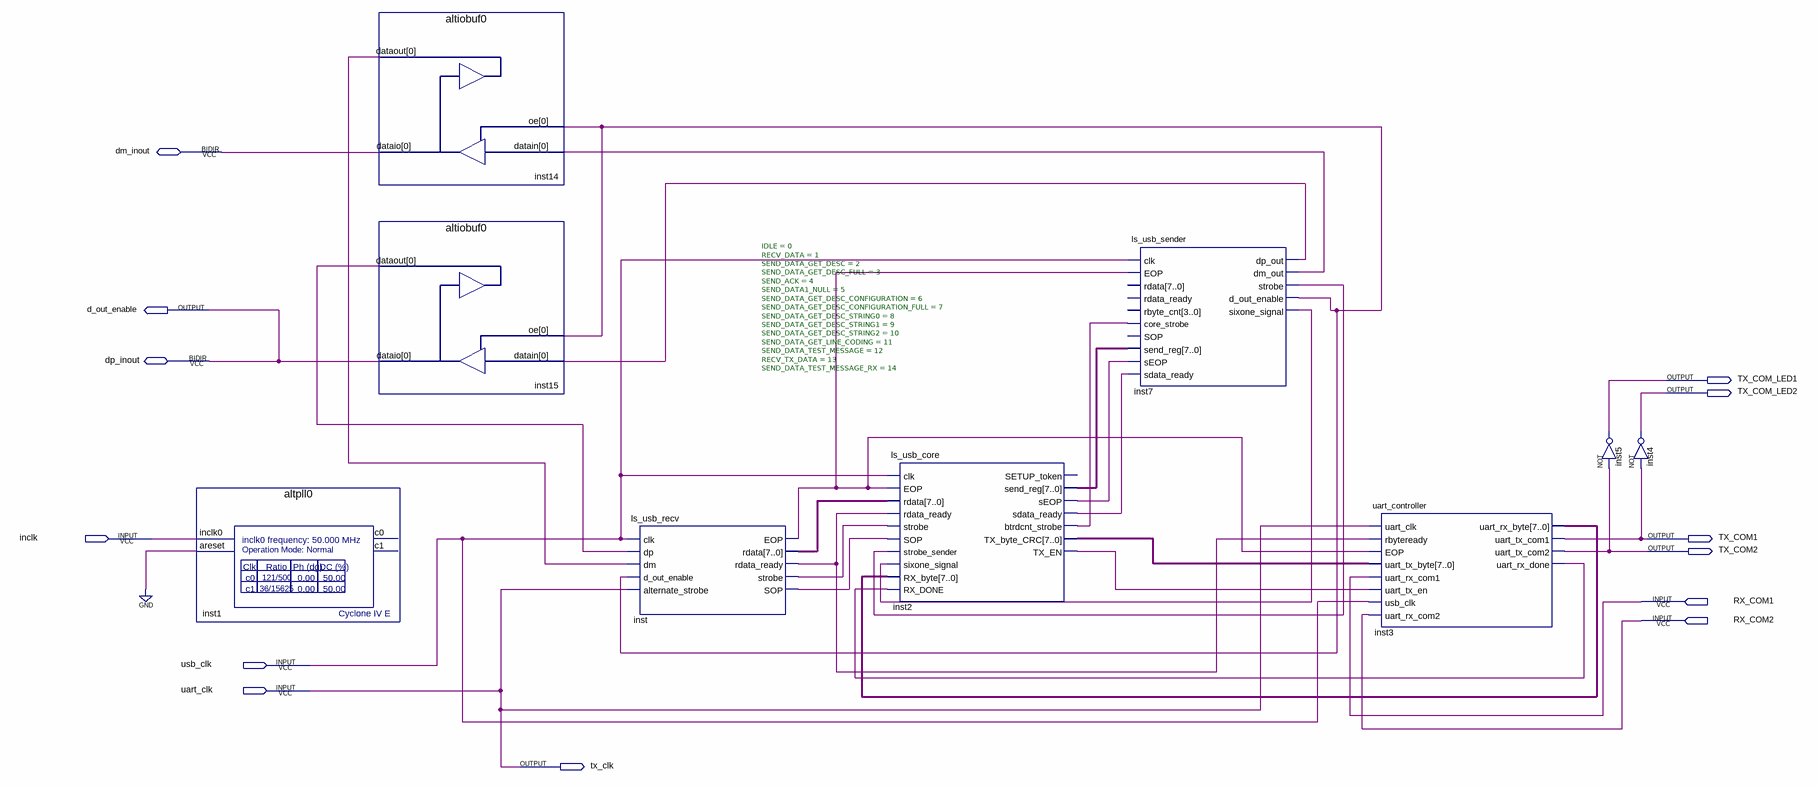
[diagram p0: schematic sheet]
// Quartus schematic Block1_temp.bdf as structural Verilog: 9 symbols, 13 pins
module Block1_temp (
  input  inclk,
  input  RX_COM1,
  input  RX_COM2,
  input  usb_clk,
  input  uart_clk,
  inout  dm_inout,
  inout  dp_inout,
  output d_out_enable,
  output TX_COM_LED1,
  output TX_COM_LED2,
  output TX_COM1,
  output TX_COM2,
  output tx_clk
);

  wire inst2_btrdcnt_strobe, inst2_sdata_ready, inst2_seop, inst2_tx_en, inst3_uart_rx_done,
       inst7_d_out_enable, inst7_dm_out, inst7_dp_out, inst7_sixone_signal, inst7_strobe, inst14_dataout,
       inst15_dataout, inst_eop, inst_rdata_ready, inst_sop, inst_strobe;
  wire [7:0] inst2_send_reg, inst2_tx_byte_crc, inst3_uart_rx_byte, inst_rdata;

  altpll0 inst1 (.inclk0(inclk), .areset(1'b0));  // open: c0, c1
  altiobuf0 inst14 (.datain(inst7_dm_out), .oe(inst7_d_out_enable), .dataout(inst14_dataout), .dataio(dm_inout));
  altiobuf0 inst15 (.datain(inst7_dp_out), .oe(inst7_d_out_enable), .dataout(inst15_dataout), .dataio(dp_inout));
  ls_usb_recv inst (
    .clk(usb_clk), .dp(inst15_dataout), .dm(inst14_dataout), .d_out_enable(inst7_d_out_enable),
    .alternate_strobe(uart_clk), .EOP(inst_eop), .rdata(inst_rdata), .rdata_ready(inst_rdata_ready),
    .strobe(inst_strobe), .SOP(inst_sop));
  ls_usb_core #(.IDLE(0), .RECV_DATA(1), .SEND_DATA_GET_DESC(2), .SEND_DATA_GET_DESC_FULL(3), .SEND_ACK(4), .SEND_DATA1_NULL(5), .SEND_DATA_GET_DESC_CONFIGURATION(6), .SEND_DATA_GET_DESC_CONFIGURATION_FULL(7), .SEND_DATA_GET_DESC_STRING0(8), .SEND_DATA_GET_DESC_STRING1(9), .SEND_DATA_GET_DESC_STRING2(10), .SEND_DATA_GET_LINE_CODING(11), .SEND_DATA_TEST_MESSAGE(12), .RECV_TX_DATA(13), .SEND_DATA_TEST_MESSAGE_RX(14)) inst2 (
    .clk(usb_clk), .EOP(inst_eop), .rdata(inst_rdata), .rdata_ready(inst_rdata_ready), .strobe(inst_strobe),
    .SOP(inst_sop), .strobe_sender(inst7_strobe), .sixone_signal(inst7_sixone_signal),
    .RX_byte(inst3_uart_rx_byte), .RX_DONE(inst3_uart_rx_done), .send_reg(inst2_send_reg), .sEOP(inst2_seop),
    .sdata_ready(inst2_sdata_ready), .btrdcnt_strobe(inst2_btrdcnt_strobe), .TX_byte_CRC(inst2_tx_byte_crc),
    .TX_EN(inst2_tx_en));  // open: SETUP_token
  ls_usb_sender inst7 (
    .clk(usb_clk), .EOP(inst_eop), .core_strobe(inst2_btrdcnt_strobe), .send_reg(inst2_send_reg),
    .sEOP(inst2_seop), .sdata_ready(inst2_sdata_ready), .dp_out(inst7_dp_out), .dm_out(inst7_dm_out),
    .strobe(inst7_strobe), .d_out_enable(inst7_d_out_enable), .sixone_signal(inst7_sixone_signal));  // open: rdata, rdata_ready, rbyte_cnt, SOP
  uart_controller inst3 (
    .uart_clk(uart_clk), .rbyteready(inst_rdata_ready), .EOP(inst_eop), .uart_tx_byte(inst2_tx_byte_crc),
    .uart_rx_com1(RX_COM1), .uart_tx_en(inst2_tx_en), .usb_clk(usb_clk), .uart_rx_com2(RX_COM2),
    .uart_rx_byte(inst3_uart_rx_byte), .uart_tx_com1(TX_COM1), .uart_tx_com2(TX_COM2),
    .uart_rx_done(inst3_uart_rx_done));
  not inst5 (TX_COM_LED1, TX_COM2);
  not inst4 (TX_COM_LED2, TX_COM1);

  assign d_out_enable = dp_inout;
  assign tx_clk = uart_clk;
endmodule
